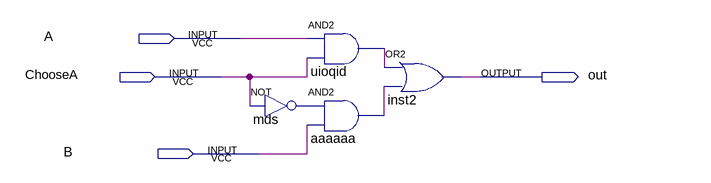
[diagram p0: schematic sheet]
// Quartus schematic Mux.bdf as structural Verilog: 4 symbols, 4 pins
module Mux (
  input  A,
  input  ChooseA,
  input  B,
  output out
);

  wire aaaaaa_out, mds_out, uioqid_out;

  not mds (mds_out, ChooseA);
  and uioqid (uioqid_out, A, ChooseA);
  and aaaaaa (aaaaaa_out, mds_out, B);
  or inst2 (out, uioqid_out, aaaaaa_out);
endmodule
